# EAGLE design Dual_powerSupply ckt diagram (EAGLE 9.6.2)
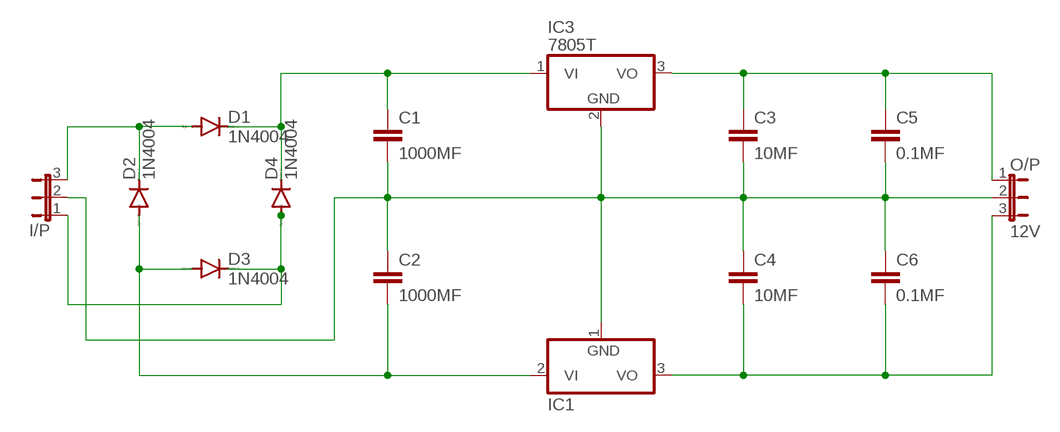
[diagram p0: schematic, sheet 1]

## Parts
C1  1000MF  C2,5-3  [C2.5-3]
C2  1000MF  C2,5-3  [C2.5-3]
C3  10MF  C2,5-3  [C2.5-3]
C4  10MF  C2,5-3  [C2.5-3]
C5  0.1MF  C2,5-3  [C2.5-3]
C6  0.1MF  C2,5-3  [C2.5-3]
D1  1N4004  [DO41-10]
D2  1N4004  [DO41-10]
D3  1N4004  [DO41-10]
D4  1N4004  [DO41-10]
I/P  JP2E  [JP2]
IC1  7905T  [TO220H]
IC3  7805T  [TO220H]
O/P  12V  JP2E  [JP2]

## Nets
N$1: D1.A D2.C I/P.3
N$2: C2.2 D2.A D3.A IC1.2(VI)
N$3: C1.2 C2.1 C3.2 C4.1 C5.2 C6.1 I/P.2 IC1.1(GND) IC3.2(GND) O/P.2
N$4: C1.1 D1.C D4.C IC3.1(VI)
N$5: D3.C D4.A I/P.1
N$6: C4.2 C6.2 IC1.3(VO) O/P.3
N$7: C3.1 C5.1 IC3.3(VO) O/P.1

## Library data of the parts
C1-C6 = capacitor-wima:C: CAPACITOR naming: grid - package width
D1-D4 = diode:1N4004: DIODE general purpose rectifier, 1 A
I/P O/P = jumper:JP2E: JUMPER
IC1 = linear:79*: Negative VOLTAGE REGULATOR
IC3 = adafruit:78*: Positive VOLTAGE REGULATOR Added bigger pads to the TO-92 package

## Board
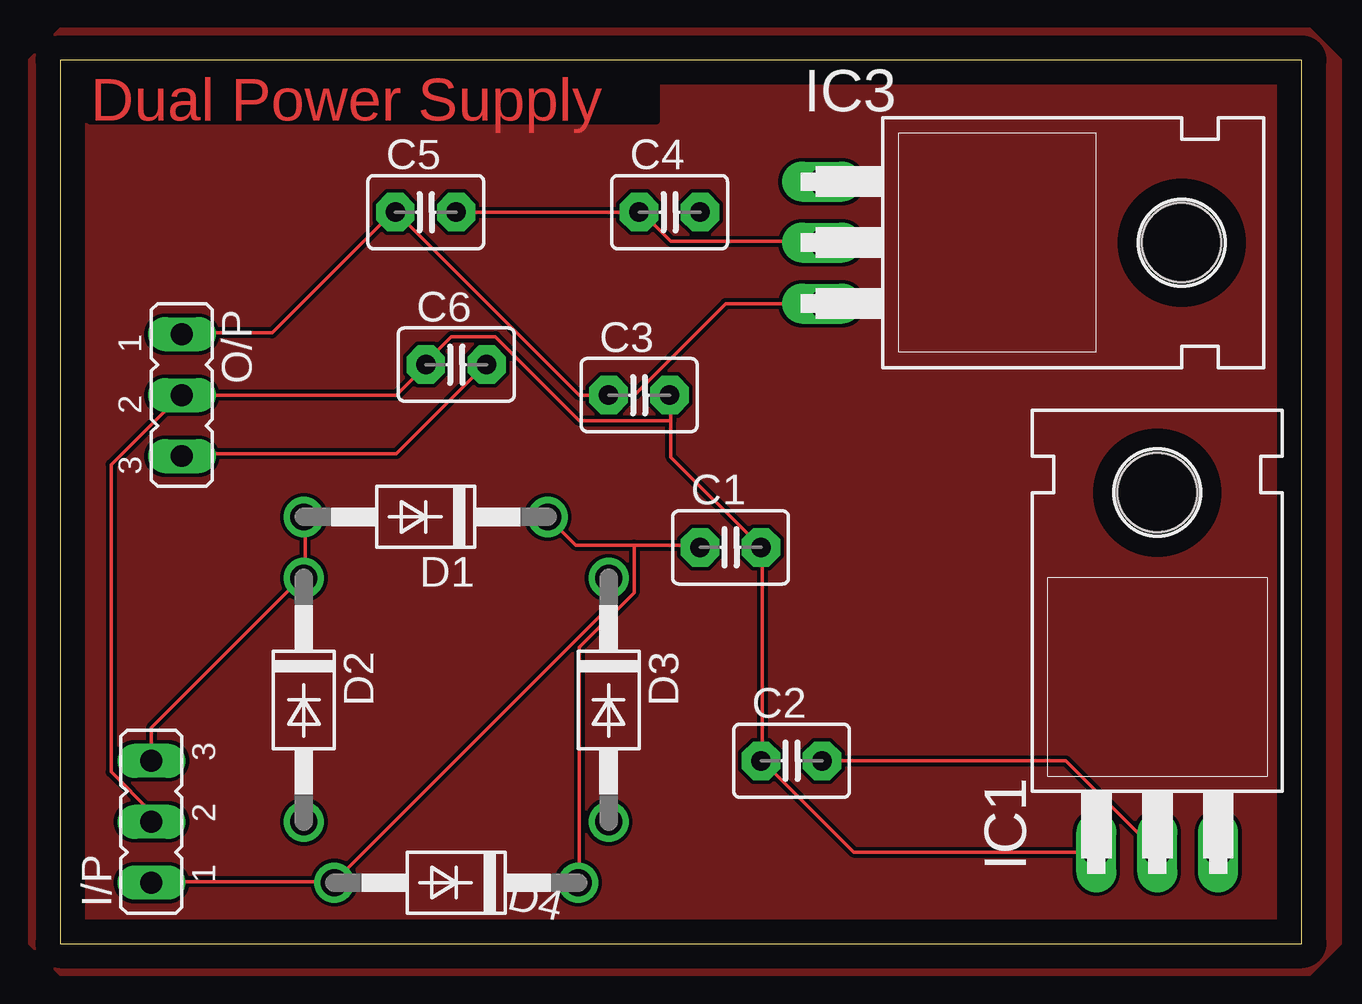
[diagram p1: board, top side]
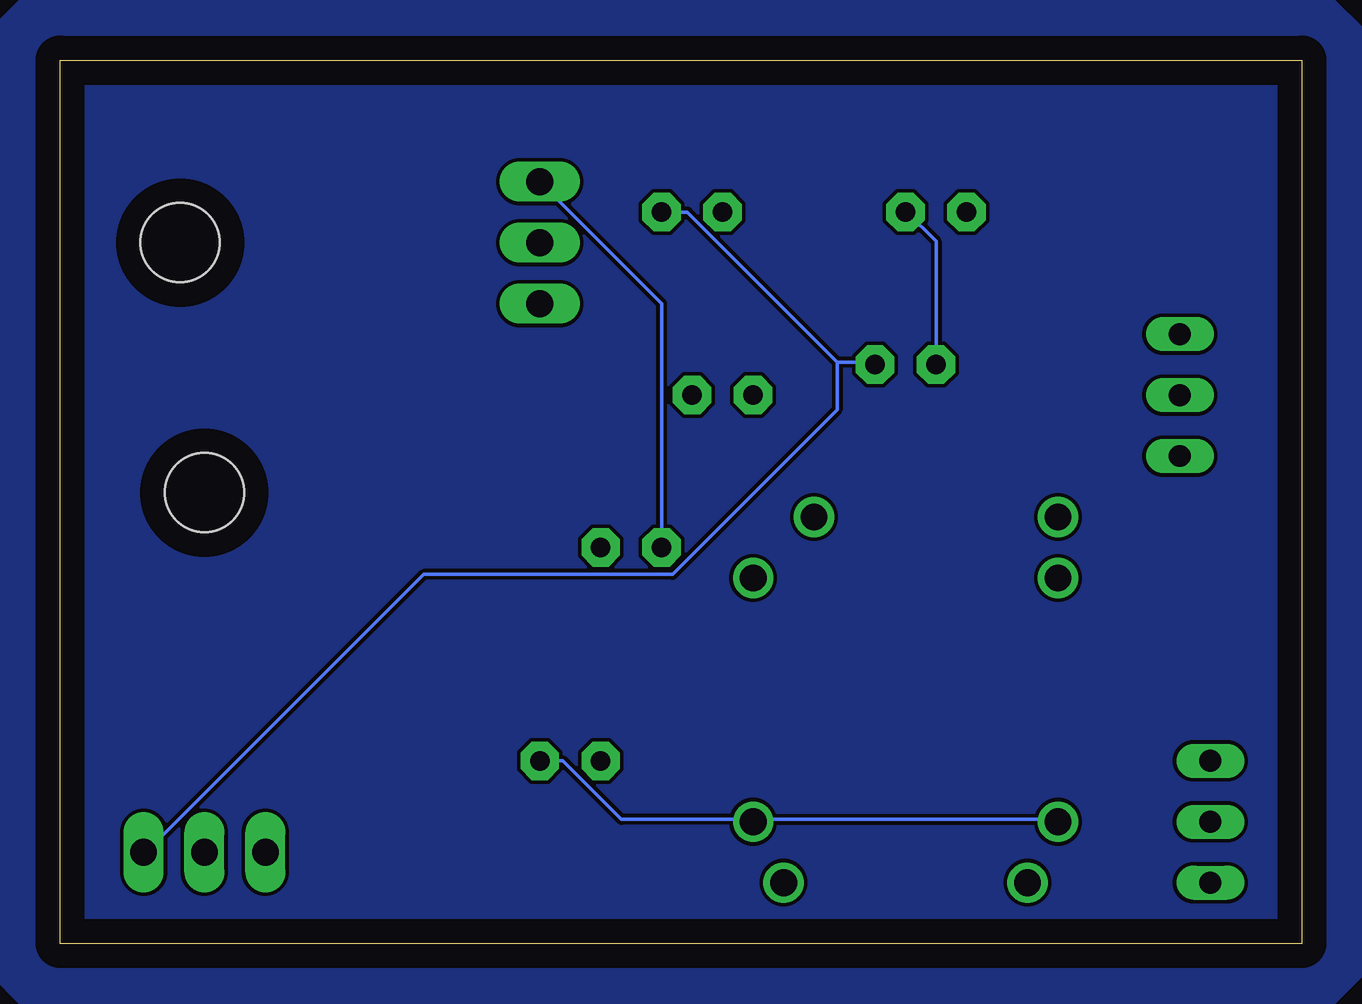
[diagram p2: board, bottom side, seen from below]

Size 51.74 x 36.82 mm. Coordinates in mm from the lower left corner, seen from the top.
Outline: 0,0 51.74,0 51.74,36.82 0,36.82 0,0
Copper layers (1*16): Top 0.035mm / dielectric 1.5mm / Bottom 0.035mm
Design rules "default": minimum track width 6mil, minimum drill 0.35mm, track to track 6mil, track to pad 6mil, pad to pad 6mil, via to via 6mil, smd to smd 6mil, copper to edge 40mil, drill to drill 6mil, minimum pad ring 10mil, minimum via ring 8mil, stop-mask expansion 4mil, vias tented up to drill 0mil, thermal gap 10mil

### Footprints (pad centres in the part's own frame; a part is rotated, then mirrored left to right if it is on the bottom)
C2.5-3 = drill 0.813 pad 1.6 octagon: 1 -1.27,0; 2 1.27,0
DO41-10 = drill 1.118: A 5.08,0; C -5.08,0
JP2 = drill 0.914 long: 1 -2.54,0; 2 0,0; 3 2.54,0
TO220H = drill 1.118 long: 1 -2.54,-10.16; 2 0,-10.16; 3 2.54,-10.16 | hole 3.302: 0,4.826

### Placement (x,y rotation side)
C1  27.94,16.51 0 top
C2  30.48,7.62 0 top
C3  24.13,22.86 0 top
C4  25.4,30.48 0 top
C5  15.24,30.48 0 top
C6  16.51,24.13 0 top
D1  15.24,17.78 180 top
D2  10.16,10.16 270 top
D3  22.86,10.16 270 top
D4  16.51,2.54 180 top
I/P  3.81,5.08 90 top
IC1  45.72,13.97 0 top
IC3  41.91,29.21 270 top
O/P  5.08,22.86 270 top

### Tracks (layer width: path | path; a pad name or v marks a point on that pad's centre or on a via)
GND
  pour Top: 0,38.1 52.07,38.1 53.34,36.83 53.34,0 52.07,-1.27 0,-1.27 -1.27,0 -1.27,36.83
  pour Bottom: -1.27,39.37 53.34,39.37 54.61,38.1 54.61,36.83 54.61,-1.27 53.34,-2.54 -1.27,-2.54 -2.54,-1.27 -2.54,36.83 -2.54,38.1
N$1
  Top 0.152: I/P.3 3.81,8.99 10.06,15.24 D2.C 10.21,15.24 10.21,17.68 D1.A
N$2
  Top 0.152: IC1.2 41.91,7.62 C2.2
  Bottom 0.152: C2.2 30.79,7.62 28.35,5.18 22.86,5.18 | 22.86,5.18 10.21,5.18 D2.A | 22.86,5.18 D3.A
N$3
  Top 0.152: 29.26,7.62 29.26,16.46 C1.2 25.45,20.27 25.45,21.79 | 25.45,21.79 25.45,22.86 C3.2 | IC1.1 33.07,3.81 29.26,7.62 | 29.26,7.62 C2.1 | I/P.2 3.81,5.49 2.13,7.16 2.13,19.96 5.03,22.86 O/P.2 14.02,22.86 15.24,24.08 C6.1 15.24,24.23 16.31,25.3 18.14,25.3 21.64,21.79 25.45,21.79 | C5.2 C4.1 24.23,30.48 25.45,29.26 31.7,29.26 IC3.2
  Bottom 0.152: C6.1 15.24,29.26 16.46,30.48 C5.2
N$4
  Top 0.152: 23.93,16.61 21.49,16.61 D1.C | 23.93,16.61 26.67,16.61 C1.1 | 23.93,16.61 23.93,14.63 21.64,12.34 21.64,2.59 D4.C
  Bottom 0.152: IC3.1 26.67,26.67 C1.1
N$5
  Top 0.152: 11.43,2.59 3.81,2.59 I/P.1 | D3.C 22.86,14.02 11.43,2.59 | 11.43,2.59 D4.A
N$6
  Top 0.152: O/P.3 5.18,20.42 14.02,20.42 17.68,24.08 C6.2
  Bottom 0.152: C4.2 25.6,30.48 19.36,24.23 | 19.36,24.23 17.83,24.23 C6.2 | 19.36,24.23 19.36,22.25 26.21,15.39 36.58,15.39 48.16,3.81 IC1.3
N$7
  Top 0.152: IC3.3 27.74,26.67 23.93,22.86 C3.1 21.64,22.86 14.02,30.48 C5.1 13.87,30.48 8.84,25.45 5.18,25.45 O/P.1

### Text on the board
Top: Dual Power Supply